# EAGLE schematic EtherMegaR3 (EAGLE 7.1.0)
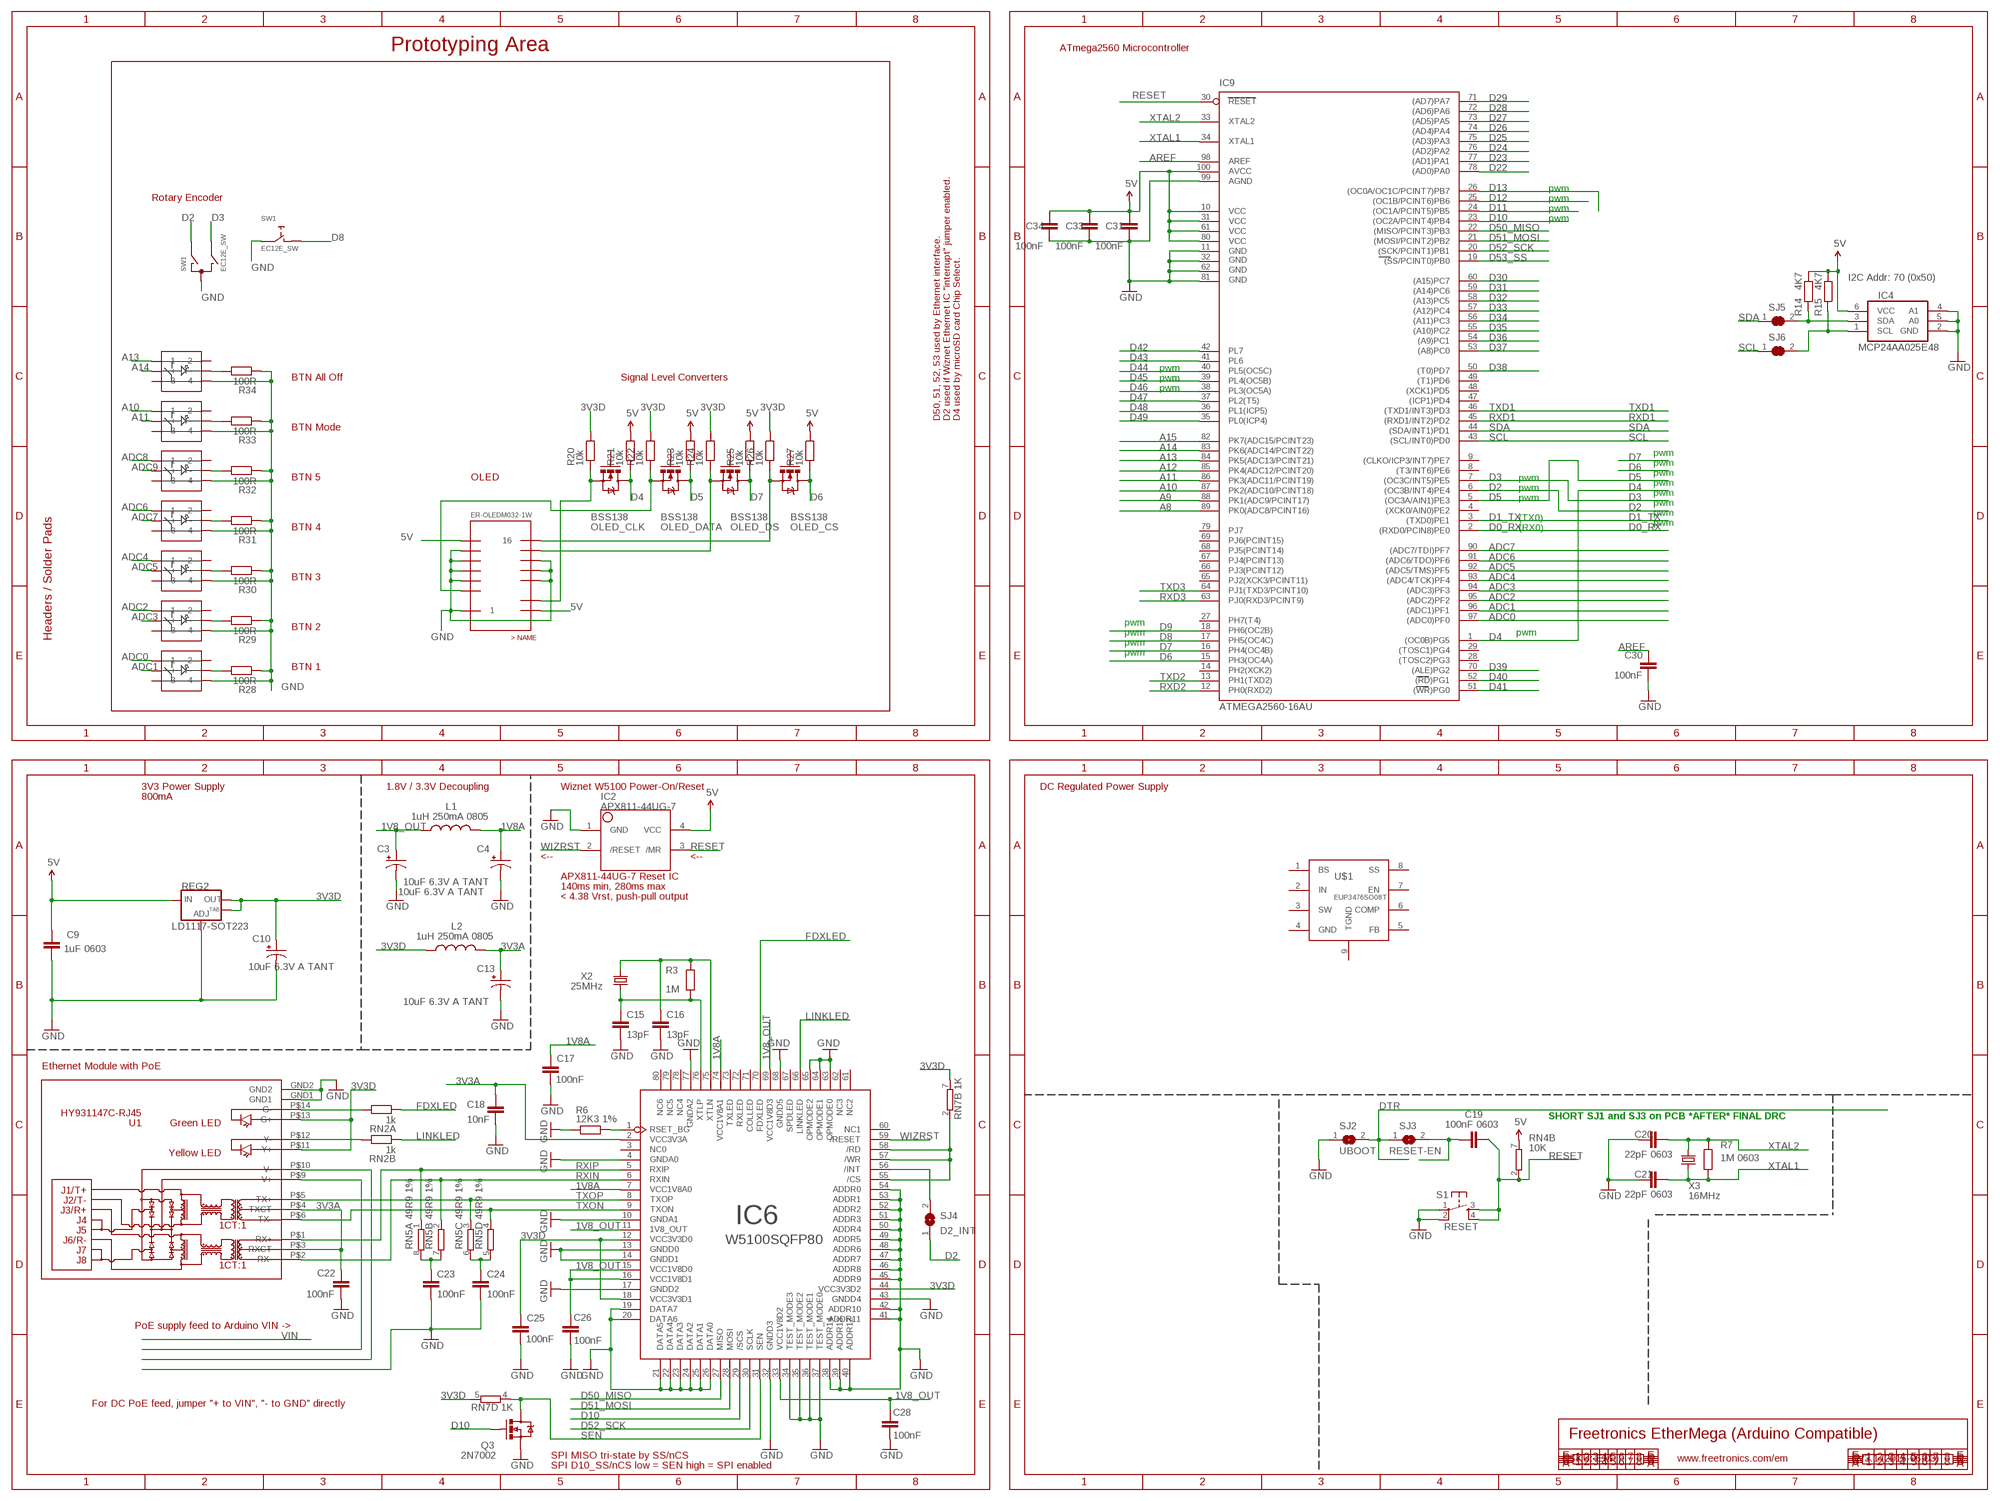
[diagram p0: schematic, sheet 1]

## Parts
BTN_FAVE1  PB614  [PB614]
BTN_FAVE2  PB614  [PB614]
BTN_FAVE3  PB614  [PB614]
BTN_FAVE4  PB614  [PB614]
BTN_FAVE5  PB614  [PB614]
BTN_MODE  PB614  [PB614]
BTN_OFF  PB614  [PB614]
C3  10uF 6.3V A TANT  CAP_POL1206  [EIA3216]
C4  10uF 6.3V A TANT  CAP_POL1206  [EIA3216]
C9  1uF 0603  CAP0603  [0603]
C10  10uF 6.3V A TANT  CAP_POL1206  [EIA3216]
C13  10uF 6.3V A TANT  CAP_POL1206  [EIA3216]
C15  13pF  CAP0603  [0603]
C16  13pF  CAP0603  [0603]
C17  100nF  CAP0603  [0603]
C18  10nF  CAP0603  [0603]
C19  100nF 0603  CAP0603  [0603]
C20  22pF 0603  CAP0603  [0603]
C21  22pF 0603  CAP0603  [0603]
C22  100nF  CAP0603  [0603]
C23  100nF  CAP0603  [0603]
C24  100nF  CAP0603  [0603]
C25  100nF  CAP0603  [0603]
C26  100nF  CAP0603  [0603]
C28  100nF  CAP0603  [0603]
C30  100nF  CAP0603  [0603]
C31  100nF  CAP0603  [0603]
C33  100nF  CAP0603  [0603]
C34  100nF  CAP0603  [0603]
IC2  APX811-44UG-7  APX81X-RESET-IC  [SOT143-R]
IC4  MCP24AA025E48  [SOT23-6]
IC6  W5100SQFP80  [SQFP80]
IC9  ATMEGA2560-16AU  ATMEGA1280-16AU  [TQFP100]
L1  1uH 250mA 0805  L-USL2012C  [L2012C]
L2  1uH 250mA 0805  L-USL2012C  [L2012C]
OLED  ER-OLED-M032-1W  [ER-OLED-M032-1W]
OLED_CLK  BSS138  MOSFET-NCHANNELSMD  [SOT23-3]
OLED_CS  BSS138  MOSFET-NCHANNELSMD  [SOT23-3]
OLED_DATA  BSS138  MOSFET-NCHANNELSMD  [SOT23-3]
OLED_DS  BSS138  MOSFET-NCHANNELSMD  [SOT23-3]
Q3  2N7002  MOSFET-NCHANNELSMD  [SOT23-3]
R3  1M  RESISTOR0603  [0603]
R6  12K3 1%  RESISTOR0603  [0603]
R7  1M 0603  RESISTOR0603  [0603]
R14  4K7  RESISTOR0603  [0603]
R15  4K7  RESISTOR0603  [0603]
R20  10k  RESISTOR0603  [0603]
R21  10k  RESISTOR0603  [0603]
R22  10k  RESISTOR0603  [0603]
R23  10k  RESISTOR0603  [0603]
R24  10k  RESISTOR0603  [0603]
R25  10k  RESISTOR0603  [0603]
R26  10k  RESISTOR0603  [0603]
R27  10k  RESISTOR0603  [0603]
R28  100R  RESISTOR0603  [0603]
R29  100R  RESISTOR0603  [0603]
R30  100R  RESISTOR0603  [0603]
R31  100R  RESISTOR0603  [0603]
R32  100R  RESISTOR0603  [0603]
R33  100R  RESISTOR0603  [0603]
R34  100R  RESISTOR0603  [0603]
REG2  LD1117-SOT223  V_REG_LM1117SOT223  [SOT223]
RN2A  1k  RESISTOR0603  [0603]
RN2B  1k  RESISTOR0603  [0603]
RN4  10K  4R-NCAY16  [CAY16]
RN5  49R9 1%  4R-NCAY16  [CAY16]
RN7  1K  4R-NCAY16  [CAY16]
S1  RESET  TAC_SWITCHSMD  [TACTILE_SWITCH_SMD]
SJ2  UBOOT  SJ  [SJ]
SJ3  RESET-EN  SJ  [SJ]
SJ4  D2_INT  SJ  [SJ]
SJ5  SJCN  [SJC]
SJ6  SJCN  [SJC]
SW1  EC12E_SW  [ALPS_EC12E_SW]
U1  HY931147C-RJ45  [HY931147C]
U$1  EUP3476SO08T  [SO08T]
X2  25MHz  CRYSTALHC49UV  [HC49U-V]
X3  16MHz  CRYSTALHC49UV  [HC49U-V]

## Nets
1V8_OUT: C3.A(+) C26.1 C28.1 IC6.11(1V8_OUT) IC6.15(VCC1V8D0) IC6.16(VCC1V8D1) IC6.33(VCC1V8D2) IC6.69(VCC1V8D3) L1.1
1V8A: C4.A(+) C17.1 IC6.7(VCC1V8A0) IC6.74(VCC1V8A1) L1.2
3V3A: C13.A(+) C18.1 C22.1 IC6.2(VCC3V3A) L2.2 U1.P$3(RXCT) U1.P$4(TXCT)
3V3D: C10.A(+) C25.1 IC6.12(VCC3V3D0) IC6.18(VCC3V3D1) IC6.44(VCC3V3D2) L2.1 R20.2 R22.2 R24.2 R26.2 REG2.2(OUT) REG2.4(OUT) RN7.5 RN7.7 U1.P$11(Y+) U1.P$13(G+)
5V [power]: C9.1 C31.1 C33.1 C34.1 IC2.4(VCC) IC4.6(VCC) IC9.10(VCC) IC9.31(VCC1) IC9.61(VCC2) IC9.80(VCC3) IC9.100(AVCC) OLED.2 OLED.15 R14.1 R15.1 R21.2 R23.2 R25.2 R27.2 REG2.3(IN) RN4.7
A8: IC9.89(PK0(ADC8/PCINT16))
A9: IC9.88(PK1(ADC9/PCINT17))
A10: BTN_MODE.1 IC9.87(PK2(ADC10/PCINT18))
A11: BTN_MODE.L+(+) IC9.86(PK3(ADC11/PCINT19))
A12: IC9.85(PK4(ADC12/PCINT20))
A13: BTN_OFF.1 IC9.84(PK5(ADC13/PCINT21))
A14: BTN_OFF.L+(+) IC9.83(PK6(ADC14/PCINT22))
A15: IC9.82(PK7(ADC15/PCINT23))
ADC0: BTN_FAVE1.1 IC9.97((ADC0)PF0)
ADC1: BTN_FAVE1.L+(+) IC9.96((ADC1)PF1)
ADC2: BTN_FAVE2.1 IC9.95((ADC2)PF2)
ADC3: BTN_FAVE2.L+(+) IC9.94((ADC3)PF3)
ADC4: BTN_FAVE3.1 IC9.93((ADC4/TCK)PF4)
ADC5: BTN_FAVE3.L+(+) IC9.92((ADC5/TMS)PF5)
ADC6: BTN_FAVE4.1 IC9.91((ADC6/TDO)PF6)
ADC7: BTN_FAVE4.L+(+) IC9.90((ADC7/TDI)PF7)
ADC8: BTN_FAVE5.1
ADC9: BTN_FAVE5.L+(+)
AREF: C30.1 IC9.98(AREF)
D0_RX: IC9.2((RXD0/PCIN8)PE0)
D1_TX: IC9.3((TXD0)PE1)
D2: IC9.6((OC3B/INT4)PE4) SJ4.1 SW1.A
D3: IC9.7((OC3C/INT5)PE5) SW1.B
D4: IC9.1((OC0B)PG5) OLED_CLK.3(D) R21.1
D5: IC9.5((OC3A/AIN1)PE3) OLED_DATA.3(D) R23.1
D6: IC9.15(PH3(OC4A)) OLED_CS.3(D) R27.1
D7: IC9.16(PH4(OC4B)) OLED_DS.3(D) R25.1
D8: IC9.17(PH5(OC4C)) SW1.D
D9: IC9.18(PH6(OC2B))
D10: IC6.29(/SCS) IC9.23((OC2A/PCINT4)PB4) Q3.1(G)
D11: IC9.24((OC1A/PCINT5)PB5)
D12: IC9.25((OC1B/PCINT6)PB6)
D13: IC9.26((OC0A/OC1C/PCINT7)PB7)
D22: IC9.78((AD0)PA0)
D23: IC9.77((AD1)PA1)
D24: IC9.76((AD2)PA2)
D25: IC9.75((AD3)PA3)
D26: IC9.74((AD4)PA4)
D27: IC9.73((AD5)PA5)
D28: IC9.72((AD6)PA6)
D29: IC9.71((AD7)PA7)
D30: IC9.60((A15)PC7)
D31: IC9.59((A14)PC6)
D32: IC9.58((A13)PC5)
D33: IC9.57((A12)PC4)
D34: IC9.56((A11)PC3)
D35: IC9.55((A10)PC2)
D36: IC9.54((A9)PC1)
D37: IC9.53((A8)PC0)
D38: IC9.50((T0)PD7)
D39: IC9.70((ALE)PG2)
D40: IC9.52((RD)PG1)
D41: IC9.51((WR)PG0)
D42: IC9.42(PL7)
D43: IC9.41(PL6)
D44: IC9.40(PL5(OC5C))
D45: IC9.39(PL4(OC5B))
D46: IC9.38(PL3(OC5A))
D47: IC9.37(PL2(T5))
D48: IC9.36(PL1(ICP5))
D49: IC9.35(PL0(ICP4))
D50_MISO: IC6.27(MISO) IC9.22((MISO/PCINT3)PB3)
D51_MOSI: IC6.28(MOSI) IC9.21((MOSI/PCINT2)PB2)
D52_SCK: IC6.30(SCLK) IC9.20((SCK/PCINT1)PB1)
D53_SS: IC9.19((SS/PCINT0)PB0)
DTR: SJ2.2 SJ3.1
FDXLED: IC6.70(FDXLED) RN2A.1
GND: BTN_FAVE1.4 BTN_FAVE2.4 BTN_FAVE3.4 BTN_FAVE4.4 BTN_FAVE5.4 BTN_MODE.4 BTN_OFF.4 C3.C(-) C4.C(-) C9.2 C10.C(-) C13.C(-) C15.2 C16.2 C17.2 C18.2 C20.1 C21.1 C22.2 C23.2 C24.2 C25.2 C26.2 C28.2 C30.2 C31.2 C33.2 C34.2 IC2.1(GND) IC4.2(GND) IC4.4(A1) IC4.5(A0) IC6.4(GNDA0) IC6.10(GNDA1) IC6.13(GNDD0) IC6.14(GNDD1) IC6.17(GNDD2) IC6.19(DATA7) IC6.20(DATA6) IC6.21(DATA5) IC6.22(DATA4) IC6.23(DATA3) IC6.24(DATA2) IC6.25(DATA1) IC6.26(DATA0) IC6.32(GNDD3) IC6.34(TEST_MODE3) IC6.35(TEST_MODE2) IC6.36(TEST_MODE1) IC6.37(TEST_MODE0) IC6.38(ADDR14) IC6.39(ADDR13) IC6.40(ADDR12) IC6.41(ADDR11) IC6.42(ADDR10) IC6.43(GNDD4) IC6.45(ADDR9) IC6.46(ADDR8) IC6.47(ADDR7) IC6.48(ADDR6) IC6.49(ADDR5) IC6.50(ADDR4) IC6.51(ADDR3) IC6.52(ADDR2) IC6.53(ADDR1) IC6.54(ADDR0) IC6.63(OPMODE0) IC6.64(OPMODE1) IC6.65(OPMODE2) IC6.68(GNDD5) IC6.77(GNDA2) IC9.11(GND) IC9.32(GND1) IC9.62(GND2) IC9.81(GND3) IC9.99(AGND) OLED.1 OLED.7 OLED.8 OLED.9 OLED.10 OLED.11 OLED.12 OLED.13 Q3.2(S) R6.1 R28.1 R29.1 R30.1 R31.1 R32.1 R33.1 R34.1 REG2.1(ADJ) S1.1 S1.2 SJ2.1 SW1.C SW1.E U1.GND1 U1.GND2
LINKLED: IC6.66(LINKLED) RN2B.1
N$1: C24.1 RN5.5 RN5.6
N$2: BTN_FAVE1.L-(-) R28.2
N$3: OLED.4 OLED_CLK.2(S) R20.1
N$4: OLED.5 OLED_DATA.2(S) R22.1
N$5: BTN_FAVE2.L-(-) R29.2
N$6: OLED.14 OLED_DS.2(S) R24.1
N$7: BTN_FAVE3.L-(-) R30.2
N$8: OLED.16 OLED_CS.2(S) R26.1
N$9: IC4.1(SCL) R15.2 SJ6.2
N$10: BTN_FAVE4.L-(-) R31.2
N$11: BTN_FAVE5.L-(-) R32.2
N$12: BTN_MODE.L-(-) R33.2
N$13: BTN_OFF.L-(-) R34.2
N$19: IC4.3(SDA) R14.2 SJ5.2
N$27: IC6.55(/CS) IC6.57(/WR) IC6.58(/RD) RN7.2
N$62: IC6.56(/INT) SJ4.2
N$67: RN2A.2 U1.P$14(G-)
N$68: U1.P$9(V+)
N$69: U1.P$10(V-)
N$75: C19.1 SJ3.2
N$321: C23.1 RN5.7 RN5.8
N$322: IC6.1(RSET_BG) R6.2
N$332: RN2B.2 U1.P$12(Y-)
RESET: C19.2 IC2.3(/MR) IC9.30(RESET) RN4.2 S1.3 S1.4
RXD1: IC9.45((RXD1/INT2)PD2)
RXD2: IC9.12(PH0(RXD2))
RXD3: IC9.63(PJ0(RXD3/PCINT9))
RXIN: IC6.6(RXIN) RN5.2 U1.P$2(RX-)
RXIP: IC6.5(RXIP) RN5.1 U1.P$1(RX+)
SCL: IC9.43((SCL/INT0)PD0) SJ6.1
SDA: IC9.44((SDA/INT1)PD1) SJ5.1
SEN: IC6.31(SEN) Q3.3(D) RN7.4
TXD1: IC9.46((TXD1/INT3)PD3)
TXD2: IC9.13(PH1(TXD2))
TXD3: IC9.64(PJ1(TXD3/PCINT10))
TXON: IC6.9(TXON) RN5.4 U1.P$6(TX-)
TXOP: IC6.8(TXOP) RN5.3 U1.P$5(TX+)
WIZRST: IC2.2(/RESET) IC6.59(/RESET)
XTAL1: C21.2 IC9.34(XTAL1) R7.1 X3.1
XTAL2: C20.2 IC9.33(XTAL2) R7.2 X3.2
XTLN: C16.1 IC6.75(XTLN) R3.2 X2.2
XTLP: C15.1 IC6.76(XTLP) R3.1 X2.1
Unconnected: BTN_FAVE1.2 BTN_FAVE1.3 BTN_FAVE2.2 BTN_FAVE2.3 BTN_FAVE3.2 BTN_FAVE3.3 BTN_FAVE4.2 BTN_FAVE4.3 BTN_FAVE5.2 BTN_FAVE5.3 BTN_MODE.2 BTN_MODE.3 BTN_OFF.2 BTN_OFF.3 IC6.3(NC0) IC6.60(NC1) IC6.61(NC2) IC6.62(NC3) IC6.67(SPDLED) IC6.71(COLLED) IC6.72(RXLED) IC6.73(TXLED) IC6.78(NC4) IC6.79(NC5) IC6.80(NC6) IC9.4((XCK0/AIN0)PE2) IC9.8((T3/INT6)PE6) IC9.9((CLKO/ICP3/INT7)PE7) IC9.14(PH2(XCK2)) IC9.27(PH7(T4)) IC9.28((TOSC2)PG3) IC9.29((TOSC1)PG4) IC9.47((ICP1)PD4) IC9.48((XCK1)PD5) IC9.49((T1)PD6) IC9.65(PJ2(XCK3/PCINT11)) IC9.66(PJ3(PCINT12)) IC9.67(PJ4(PCINT13)) IC9.68(PJ5(PCINT14)) IC9.69(PJ6(PCINT15)) IC9.79(PJ7) OLED_CLK.1(G) OLED_CS.1(G) OLED_DATA.1(G) OLED_DS.1(G) RN4.1 RN4.3 RN4.4 RN4.5 RN4.6 RN4.8 RN7.1 RN7.3 RN7.6 RN7.8 U$1.1(BS) U$1.3(SW) U$1.5(FB) U$1.6(COMP) U$1.7(EN) U$1.8(SS)

## Notes on the sheet
- Prototyping Area | ATmega2560 Microcontroller
- pwm
- Rotary Encoder | pwm
- pwm
- pwm
- I2C Addr: 70 (0x50)
- pwm
- BTN All Off | Signal Level Converters | pwm
- pwm
- D50, 51, 52, 53 used by Ethernet interface. | D2 used if Wiznet Ethernet IC "interrupt" jumper enabled. | D4 used by microSD card Chip Select.
- BTN Mode
- pwm
- pwm
- pwm
- BTN 5 | OLED | pwm
- pwm
- pwm
- pwm
- pwm
- pwm
- pwm
- (TX0)
- pwm
- BTN 4 | (RX0)
- BTN 3
- pwm
- BTN 2
- pwm | pwm
- Headers / Solder Pads
- pwm
- pwm
- BTN 1
- 3V3 Power Supply | 1.8V / 3.3V Decoupling | Wiznet W5100 Power-On/Reset | DC Regulated Power Supply
- 800mA
- <-- | <--
- APX811-44UG-7 Reset IC
- 140ms min, 280ms max
- < 4.38 Vrst, push-pull output
- Ethernet Module with PoE
- SHORT SJ1 and SJ3 on PCB *AFTER* FINAL DRC
- PoE supply feed to Arduino VIN ->
- For DC PoE feed, jumper "+ to VIN", "- to GND" directly
- Freetronics EtherMega (Arduino Compatible)
- SPI MISO tri-state by SS/nCS
- SKU: EM | www.freetronics.com/em | V3.1 (2015-06-03)
- SPI D10_SS/nCS low = SEN high = SPI enabled

## Power pins joined to a net without a drawn wire
GND: U$1.4(GND)
IN: U$1.2(IN)
TGND: U$1.9(TGND)

## Library data of the parts
BTN_FAVE1-BTN_FAVE5 BTN_MODE BTN_OFF = RSJ-PB614:PB614
C3 C4 C10 C13 = freetronics:CAP_POL: Capacitor Polarized These are standard SMD and PTH capacitors. Normally 10uF, 47uF, and 100uF in electrolytic and tantalum varieties. Always verify the external diameter of the through hole cap, it varies with capacity, voltage, and manufacturer. The EIA devices should be standard.
C9 C15-C26 C28 C30 C31 C33 C34 = freetronics-marc:CAP: Capacitor Standard 0603 ceramic capacitor, and 0.1" leaded capacitor.
IC2 = freetronics-master-v1:APX81X-RESET-IC
IC4 = freetronics-jon:MCP24AA025E48
IC6 = freetronics-marc:W5100: WIZnet W5100
IC9 = atmel-2005:ATMEGA*: MICROCONTROLLER 64/128/256 Kbytes FLASH 4 Kbytes EEPROM 8 Kbytes SRAM 86 General Purpose I/O pins 12-channels16-bit PWM 4 x Serial USARTs 16-channels 10-bit A/D
L1 L2 = rcl:L-US: INDUCTOR, American symbol
OLED = Mat-Library:ER-OLED-M032-1W: 256x64 White OLED from buydisplay.com. ER-OLED-M032-1W ER = East Rising (Manufacturer) OLED = OLED M = module - this is the product with the driver board
OLED_CLK OLED_CS OLED_DATA OLED_DS = SparkFun:MOSFET-NCHANNEL
Q3 = freetronics:MOSFET-NCHANNEL
R3 R6 R7 R20-R34 RN2A RN2B = freetronics-marc:RESISTOR: Resistor Basic schematic elements and footprints for 0603, 1206, and PTH 1/10th watt (small) resistors.
R14 R15 = freetronics-master-v1.1:RESISTOR: Resistor Basic schematic elements and footprints for 0603, 1206, and PTH 1/10th watt (small) resistors.
REG2 = freetronics:V_REG_LM1117: Voltage Regulator LD1117 Adjustable low-dropout voltage regulator available in SOT89 and SOT223 SMT packages.
RN4 RN5 RN7 = freetronics-master-v1:4R-N: Array Chip Resistor Source: RS Component / Phycomp
S1 = freetronics:TAC_SWITCH: Momentary Switch Button commonly used for reset or general input. Spark Fun Electronics SKU : COM-00097
SJ2-SJ4 = jumper:SJ: SMD solder JUMPER
SJ5 SJ6 = freetronics-jon:SJC
SW1 = switch-alps:EC12E_SW: ALPS rotary Encoder EC12E series with switch; MPN: EC12E2424407; OC_FARNELL: 1520813; OC_NEWARK: 74M1068
U1 = freetronics-jon:HY931147C
U$1 = freetronics-jon:EUP3476
X2 X3 = freetronics-master-v1:CRYSTAL: Crystals Various standard crystals. Proven footprints. Spark Fun Electronics SKU : COM-00534